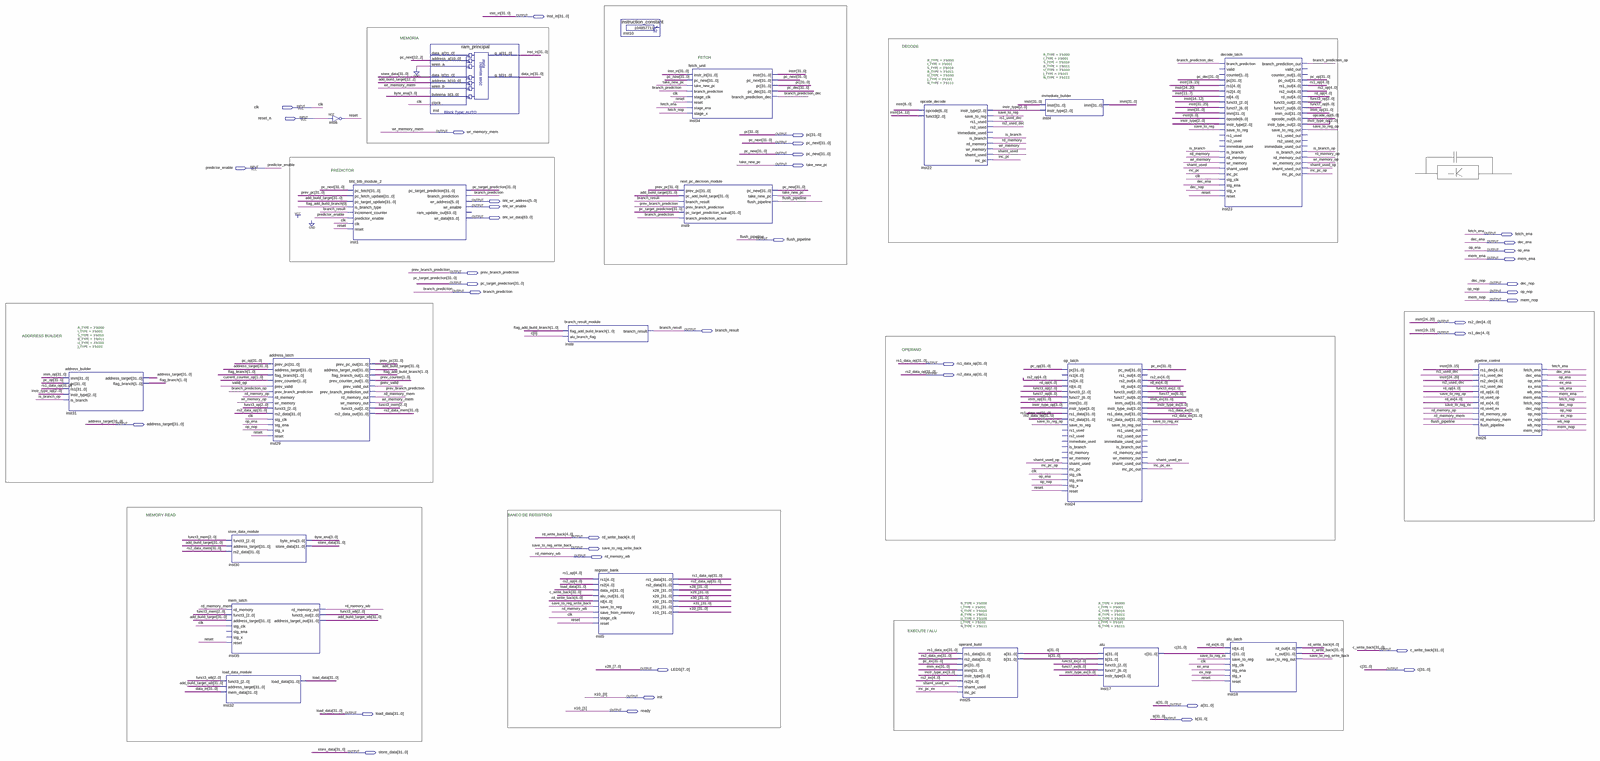
[diagram p0: schematic sheet, whole]
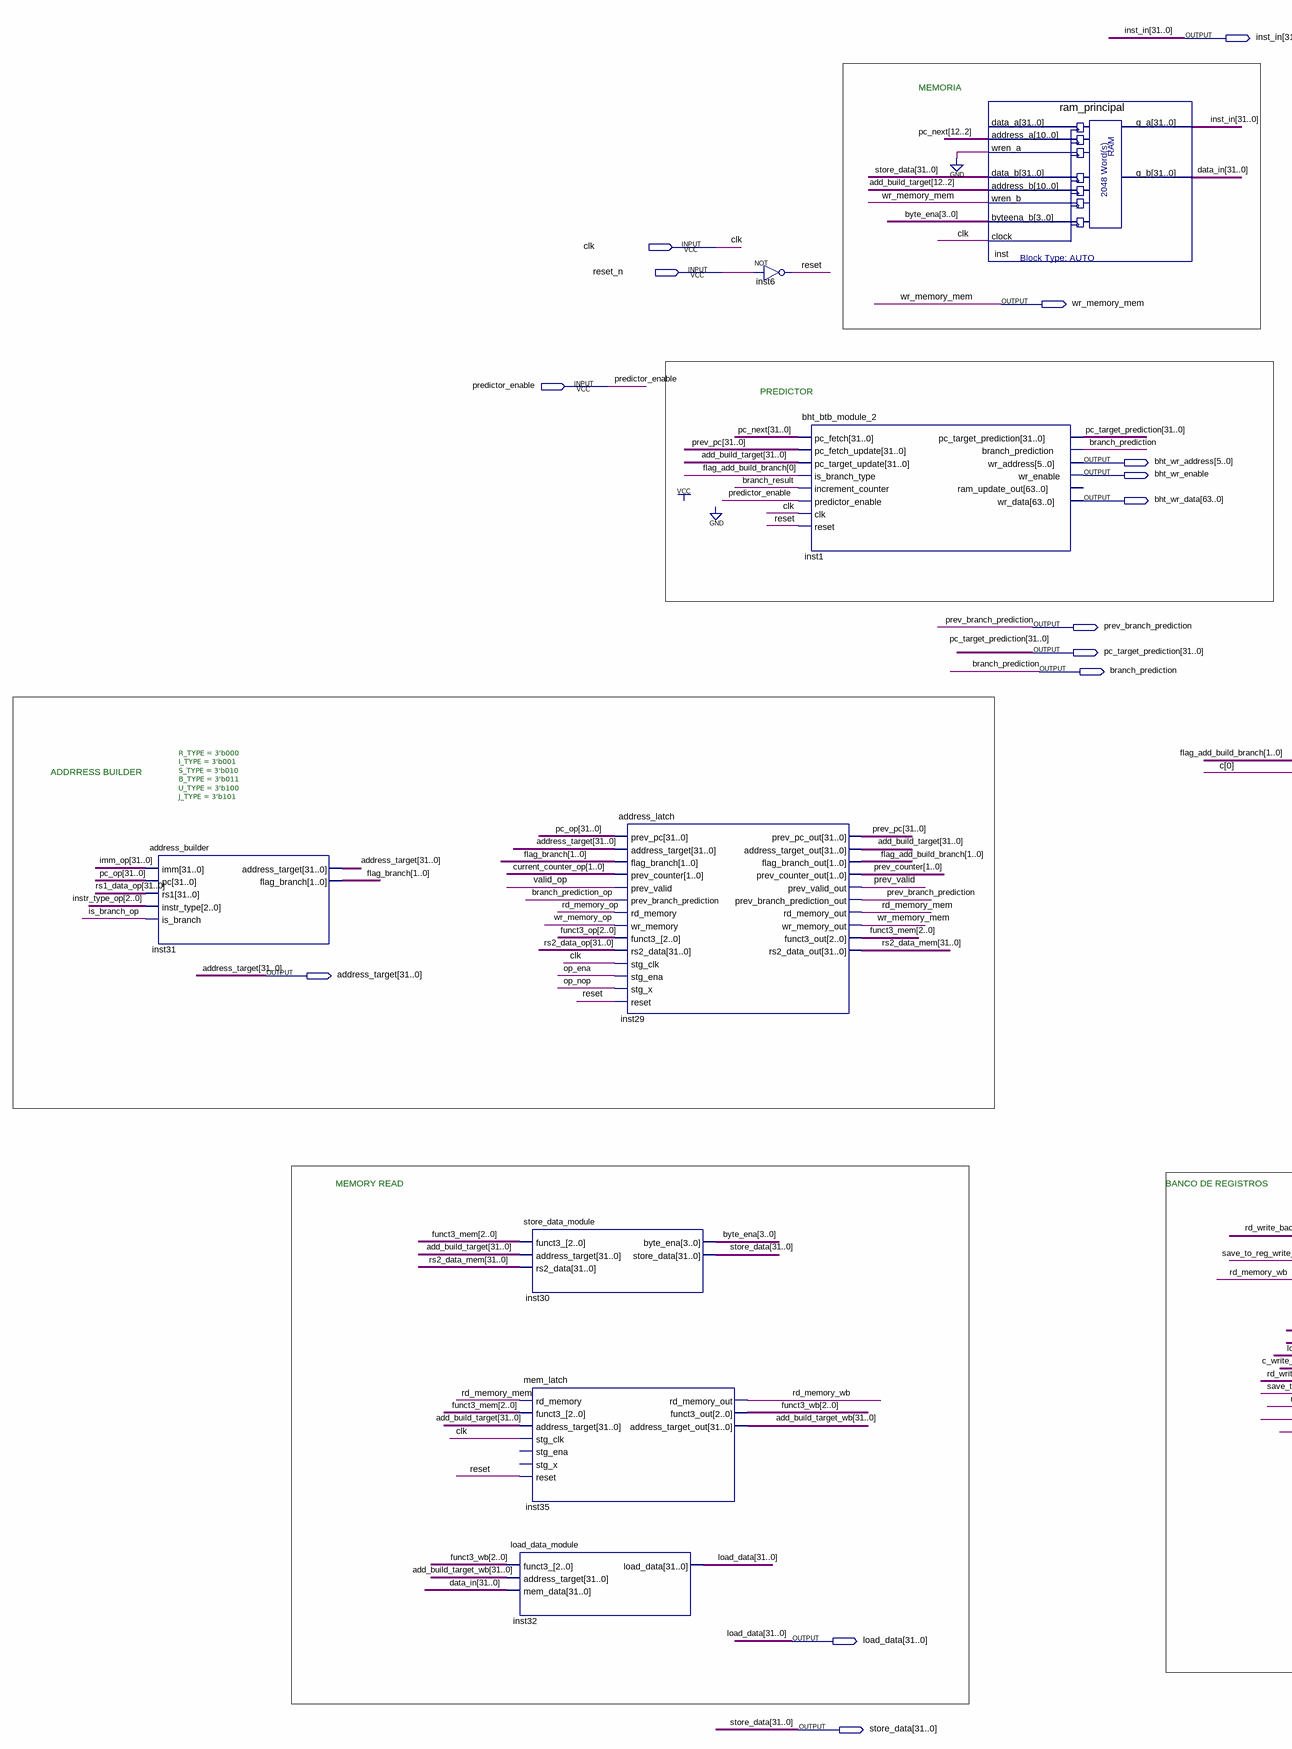
[diagram p1: schematic sheet, left part]
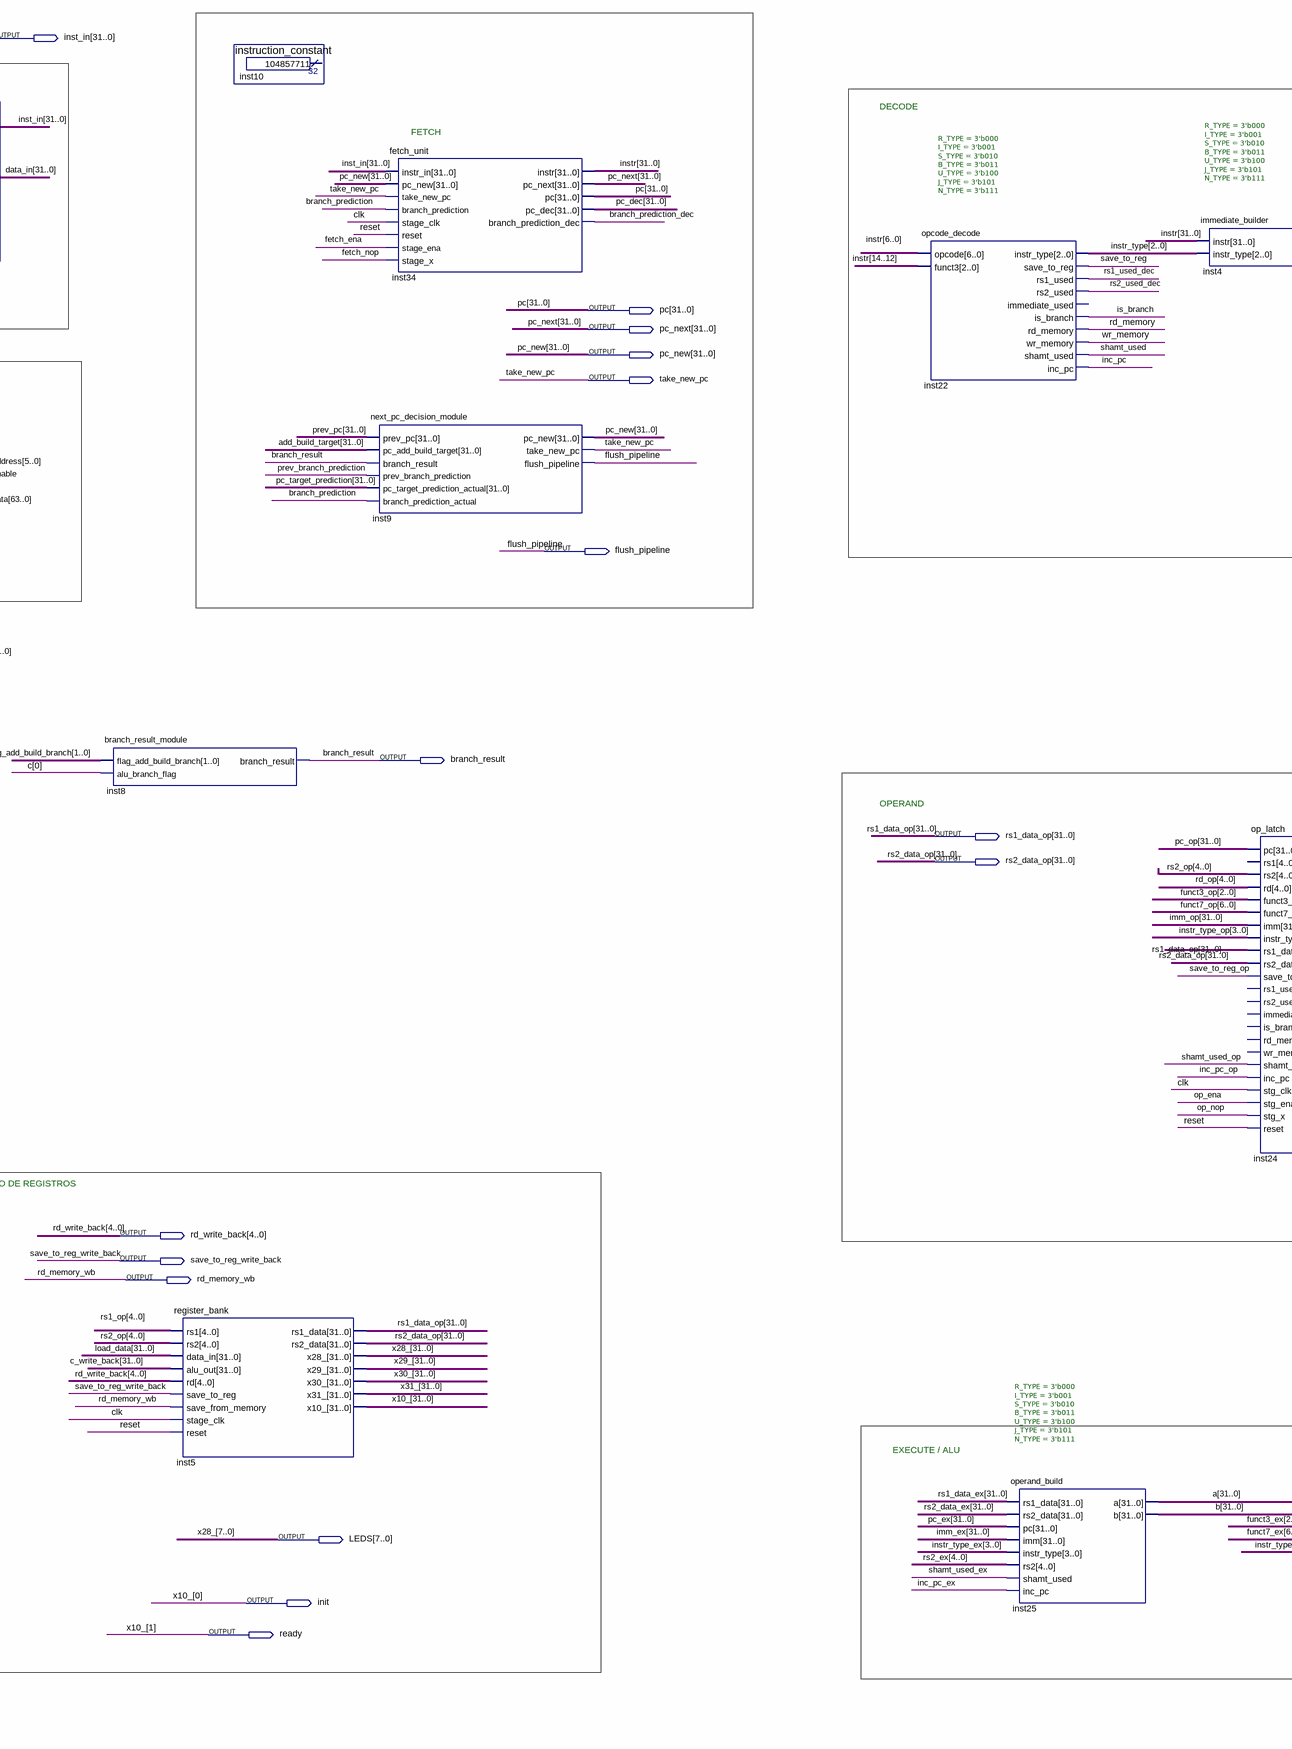
[diagram p2: schematic sheet, centre part]
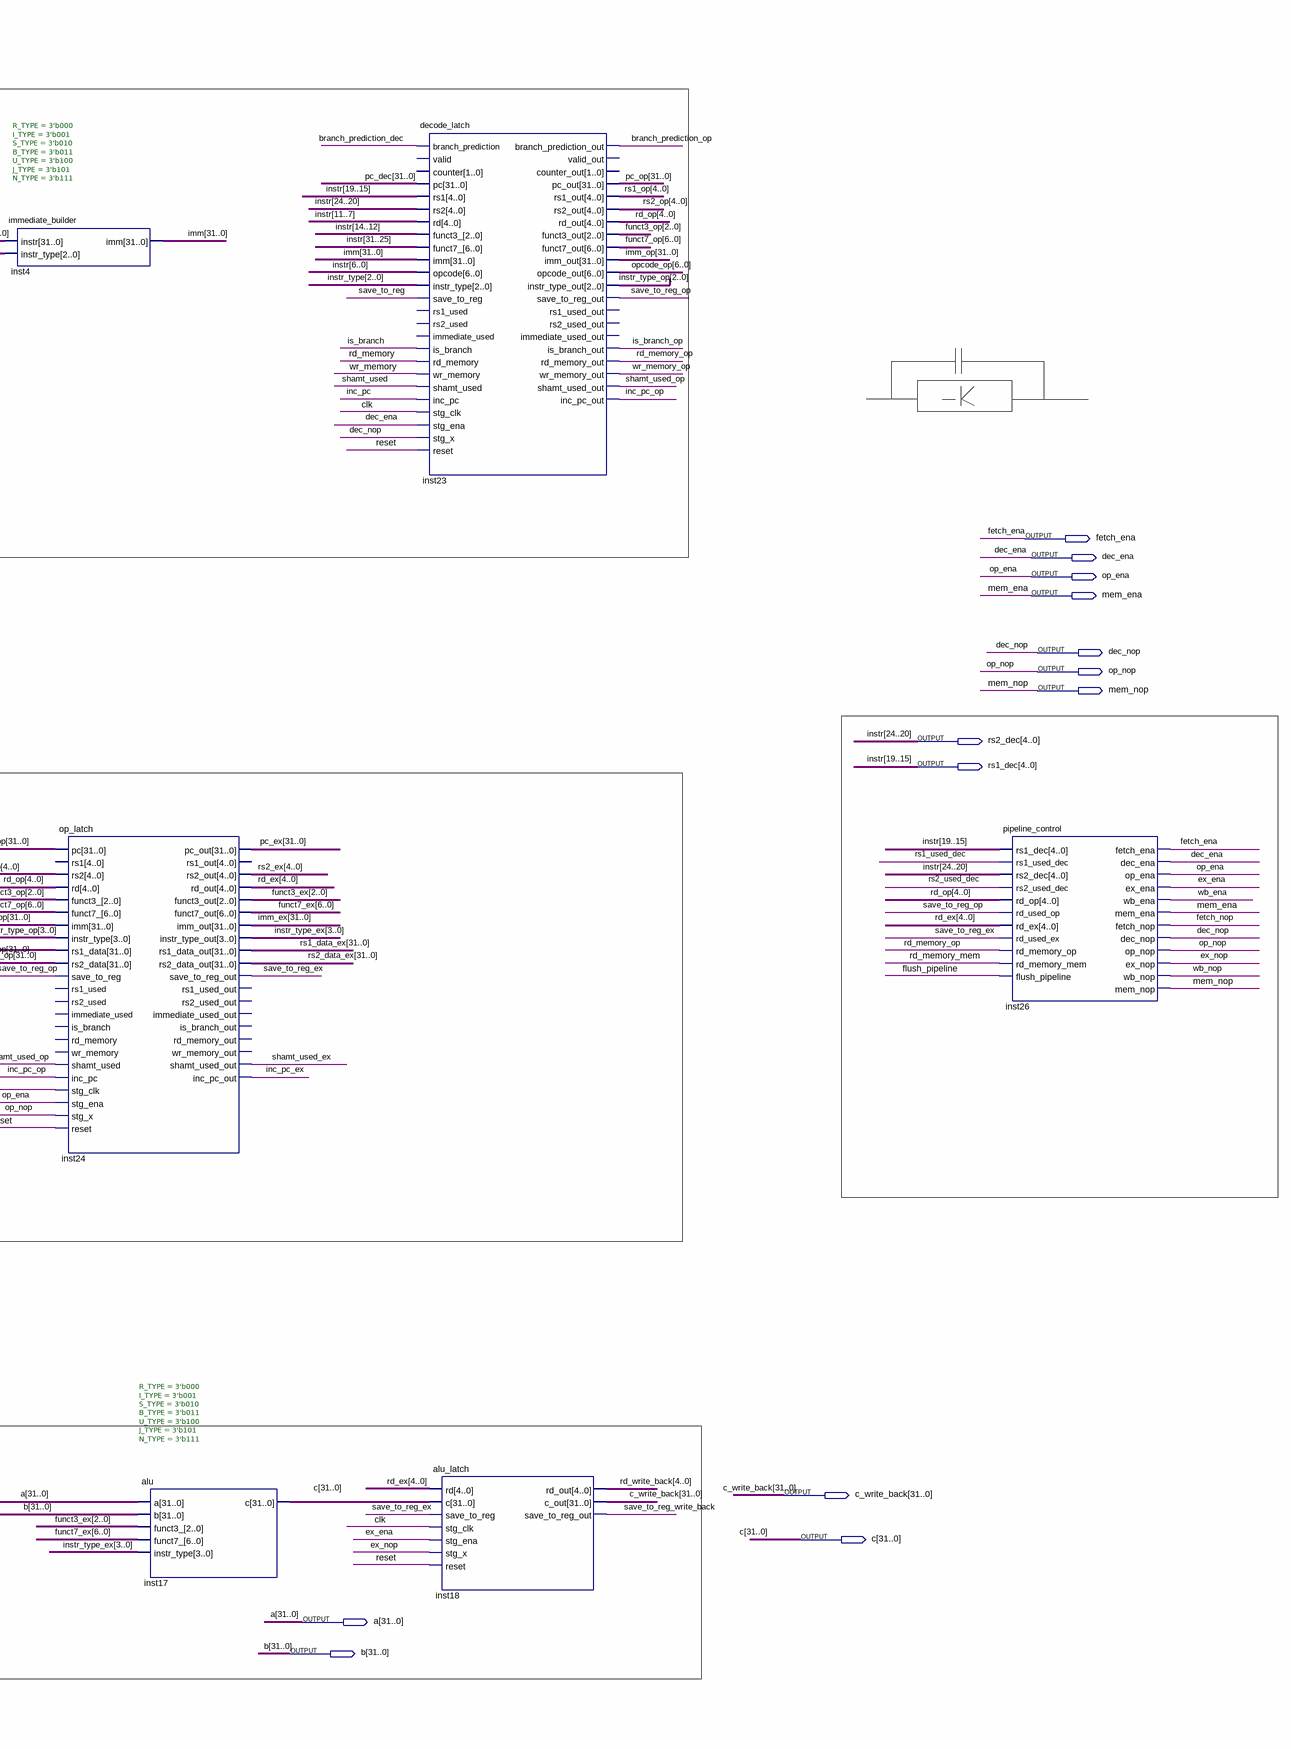
[diagram p3: schematic sheet, right part]
// Quartus schematic tp2_e5_ERV25_grupo2.bdf as structural Verilog: 21 symbols, 41 pins
module tp2_e5_ERV25_grupo2 (
  input  clk,
  input  reset_n,
  input  predictor_enable,
  output [31:0] inst_in,
  output wr_memory_mem,
  output [31:0] pc,
  output [31:0] pc_next,
  output [31:0] pc_new,
  output take_new_pc,
  output [5:0] bht_wr_address,
  output bht_wr_enable,
  output [63:0] bht_wr_data,
  output fetch_ena,
  output flush_pipeline,
  output dec_ena,
  output op_ena,
  output mem_ena,
  output prev_branch_prediction,
  output [31:0] pc_target_prediction,
  output dec_nop,
  output branch_prediction,
  output op_nop,
  output mem_nop,
  output [4:0] rs2_dec,
  output branch_result,
  output [4:0] rs1_dec,
  output [31:0] rs1_data_op,
  output [31:0] rs2_data_op,
  output [31:0] address_target,
  output [4:0] rd_write_back,
  output save_to_reg_write_back,
  output rd_memory_wb,
  output [31:0] c_write_back,
  output [7:0] LEDS,
  output [31:0] c,
  output init,
  output [31:0] a,
  output ready,
  output [31:0] load_data,
  output [31:0] b,
  output [31:0] store_data
);

  wire branch_prediction_dec, branch_prediction_op, ex_ena, ex_nop, fetch_nop, inc_pc, inc_pc_ex, inc_pc_op,
       is_branch, is_branch_op, prev_valid, rd_memory, rd_memory_mem, rd_memory_op, reset, rs1_used_dec,
       rs2_used_dec, save_to_reg, save_to_reg_ex, save_to_reg_op, shamt_used, shamt_used_ex, shamt_used_op,
       valid_op, wb_ena, wb_nop, wr_memory, wr_memory_op;
  wire [1:0] current_counter_op, flag_add_build_branch, flag_branch, prev_counter;
  wire [2:0] funct3_ex, funct3_mem, funct3_op, funct3_wb, instr_type;
  wire [3:0] byte_ena, instr_type_ex, instr_type_op;
  wire [4:0] rd_ex, rd_op, rs1_op, rs2_ex, rs2_op;
  wire [6:0] funct7_ex, funct7_op, opcode_op;
  wire [31:0] add_build_target, add_build_target_wb, data_in, imm, imm_ex, imm_op, instr, pc_dec, pc_ex,
       pc_op, prev_pc, rs1_data_ex, rs2_data_ex, rs2_data_mem, x29_, x30_, x31_;
  wire [31:2] x10_;
  wire [31:8] x28_;

  address_builder #(.R_TYPE(3'b000), .I_TYPE(3'b001), .S_TYPE(3'b010), .B_TYPE(3'b011), .U_TYPE(3'b100), .J_TYPE(3'b101)) inst31 (
    .imm(imm_op), .pc(pc_op), .rs1(rs1_data_op), .instr_type(instr_type_op[2:0]), .is_branch(is_branch_op),
    .address_target(address_target), .flag_branch(flag_branch));
  store_data_module inst30 (
    .funct3_(funct3_mem), .address_target(add_build_target), .rs2_data(rs2_data_mem), .byte_ena(byte_ena),
    .store_data(store_data));
  mem_latch inst35 (
    .rd_memory(rd_memory_mem), .funct3_(funct3_mem), .address_target(add_build_target), .stg_clk(clk),
    .reset(reset), .rd_memory_out(rd_memory_wb), .funct3_out(funct3_wb),
    .address_target_out(add_build_target_wb));  // open: stg_ena, stg_x
  load_data_module inst32 (
    .funct3_(funct3_wb), .address_target(add_build_target_wb), .mem_data(data_in), .load_data(load_data));
  address_latch inst29 (
    .prev_pc(pc_op), .address_target(address_target), .flag_branch(flag_branch),
    .prev_counter(current_counter_op), .prev_valid(valid_op), .prev_branch_prediction(branch_prediction_op),
    .rd_memory(rd_memory_op), .wr_memory(wr_memory_op), .funct3_(funct3_op), .rs2_data(rs2_data_op),
    .stg_clk(clk), .stg_ena(op_ena), .stg_x(op_nop), .reset(reset), .prev_pc_out(prev_pc),
    .address_target_out(add_build_target), .flag_branch_out(flag_add_build_branch),
    .prev_counter_out(prev_counter), .prev_valid_out(prev_valid),
    .prev_branch_prediction_out(prev_branch_prediction), .rd_memory_out(rd_memory_mem),
    .wr_memory_out(wr_memory_mem), .funct3_out(funct3_mem), .rs2_data_out(rs2_data_mem));
  not inst6 (reset, reset_n);
  bht_btb_module_2 inst1 (
    .pc_fetch(pc_next), .pc_fetch_update(prev_pc), .pc_target_update(add_build_target),
    .is_branch_type(flag_add_build_branch[0]), .increment_counter(branch_result),
    .predictor_enable(predictor_enable), .clk(clk), .reset(reset),
    .pc_target_prediction(pc_target_prediction), .branch_prediction(branch_prediction),
    .wr_address(bht_wr_address), .wr_enable(bht_wr_enable), .wr_data(bht_wr_data));  // open: ram_update_out
  ram_principal inst (
    .address_a(pc_next[12:2]), .wren_a(1'b0), .data_b(store_data), .address_b(add_build_target[12:2]),
    .wren_b(wr_memory_mem), .byteena_b(byte_ena), .clock(clk), .q_a(inst_in), .q_b(data_in));  // open: data_a
  branch_result_module inst8 (
    .flag_add_build_branch(flag_add_build_branch), .alu_branch_flag(c[0]), .branch_result(branch_result));
  register_bank inst5 (
    .rs1(rs1_op), .rs2(rs2_op), .data_in(load_data), .alu_out(c_write_back), .rd(rd_write_back),
    .save_to_reg(save_to_reg_write_back), .save_from_memory(rd_memory_wb), .stage_clk(clk), .reset(reset),
    .rs1_data(rs1_data_op), .rs2_data(rs2_data_op), .x28_({x28_, LEDS}), .x29_(x29_), .x30_(x30_),
    .x31_(x31_), .x10_({x10_, ready, init}));
  instruction_constant inst10 ();  // open: result
  fetch_unit inst34 (
    .instr_in(inst_in), .pc_new(pc_new), .take_new_pc(take_new_pc), .branch_prediction(branch_prediction),
    .stage_clk(clk), .reset(reset), .stage_ena(fetch_ena), .stage_x(fetch_nop),
    .instr({instr[31:25], rs2_dec, rs1_dec, instr[14:0]}), .pc_next(pc_next), .pc(pc), .pc_dec(pc_dec),
    .branch_prediction_dec(branch_prediction_dec));
  next_pc_decision_module inst9 (
    .prev_pc(prev_pc), .pc_add_build_target(add_build_target), .branch_result(branch_result),
    .prev_branch_prediction(prev_branch_prediction), .pc_target_prediction_actual(pc_target_prediction),
    .branch_prediction_actual(branch_prediction), .pc_new(pc_new), .take_new_pc(take_new_pc),
    .flush_pipeline(flush_pipeline));
  opcode_decode #(.R_TYPE(3'b000), .I_TYPE(3'b001), .S_TYPE(3'b010), .B_TYPE(3'b011), .U_TYPE(3'b100), .J_TYPE(3'b101), .N_TYPE(3'b111)) inst22 (
    .opcode(instr[6:0]), .funct3(instr[14:12]), .instr_type(instr_type), .save_to_reg(save_to_reg),
    .rs1_used(rs1_used_dec), .rs2_used(rs2_used_dec), .is_branch(is_branch), .rd_memory(rd_memory),
    .wr_memory(wr_memory), .shamt_used(shamt_used), .inc_pc(inc_pc));  // open: immediate_used
  operand_build #(.R_TYPE(3'b000), .I_TYPE(3'b001), .S_TYPE(3'b010), .B_TYPE(3'b011), .U_TYPE(3'b100), .J_TYPE(3'b101), .N_TYPE(3'b111)) inst25 (
    .rs1_data(rs1_data_ex), .rs2_data(rs2_data_ex), .pc(pc_ex), .imm(imm_ex), .instr_type(instr_type_ex),
    .rs2(rs2_ex), .shamt_used(shamt_used_ex), .inc_pc(inc_pc_ex), .a(a), .b(b));
  immediate_builder #(.R_TYPE(3'b000), .I_TYPE(3'b001), .S_TYPE(3'b010), .B_TYPE(3'b011), .U_TYPE(3'b100), .J_TYPE(3'b101), .N_TYPE(3'b111)) inst4 (
    .instr({instr[31:25], rs2_dec, rs1_dec, instr[14:0]}), .instr_type(instr_type), .imm(imm));
  op_latch inst24 (
    .pc(pc_op), .rs2(rs2_op), .rd(rd_op), .funct3_(funct3_op), .funct7_(funct7_op), .imm(imm_op),
    .instr_type(instr_type_op), .rs1_data(rs1_data_op), .rs2_data(rs2_data_op), .save_to_reg(save_to_reg_op),
    .shamt_used(shamt_used_op), .inc_pc(inc_pc_op), .stg_clk(clk), .stg_ena(op_ena), .stg_x(op_nop),
    .reset(reset), .pc_out(pc_ex), .rs2_out(rs2_ex), .rd_out(rd_ex), .funct3_out(funct3_ex),
    .funct7_out(funct7_ex), .imm_out(imm_ex), .instr_type_out(instr_type_ex), .rs1_data_out(rs1_data_ex),
    .rs2_data_out(rs2_data_ex), .save_to_reg_out(save_to_reg_ex), .shamt_used_out(shamt_used_ex),
    .inc_pc_out(inc_pc_ex));  // open: rs1, rs1_used, rs2_used, immediate_used, is_branch, rd_memory, wr_memory, rs1_out, rs1_used_out, rs2_used_out, immediate_used_out, is_branch_out, rd_memory_out, wr_memory_out
  alu #(.R_TYPE(3'b000), .I_TYPE(3'b001), .S_TYPE(3'b010), .B_TYPE(3'b011), .U_TYPE(3'b100), .J_TYPE(3'b101), .N_TYPE(3'b111)) inst17 (
    .a(a), .b(b), .funct3_(funct3_ex), .funct7_(funct7_ex), .instr_type(instr_type_ex), .c(c));
  decode_latch inst23 (
    .branch_prediction(branch_prediction_dec), .pc(pc_dec), .rs1(rs1_dec), .rs2(rs2_dec), .rd(instr[11:7]),
    .funct3_(instr[14:12]), .funct7_(instr[31:25]), .imm(imm), .opcode(instr[6:0]), .instr_type(instr_type),
    .save_to_reg(save_to_reg), .is_branch(is_branch), .rd_memory(rd_memory), .wr_memory(wr_memory),
    .shamt_used(shamt_used), .inc_pc(inc_pc), .stg_clk(clk), .stg_ena(dec_ena), .stg_x(dec_nop),
    .reset(reset), .branch_prediction_out(branch_prediction_op), .pc_out(pc_op), .rs1_out(rs1_op),
    .rs2_out(rs2_op), .rd_out(rd_op), .funct3_out(funct3_op), .funct7_out(funct7_op), .imm_out(imm_op),
    .opcode_out(opcode_op), .instr_type_out(instr_type_op[2:0]), .save_to_reg_out(save_to_reg_op),
    .is_branch_out(is_branch_op), .rd_memory_out(rd_memory_op), .wr_memory_out(wr_memory_op),
    .shamt_used_out(shamt_used_op), .inc_pc_out(inc_pc_op));  // open: valid, counter, rs1_used, rs2_used, immediate_used, valid_out, counter_out, rs1_used_out, rs2_used_out, immediate_used_out
  alu_latch inst18 (
    .rd(rd_ex), .c(c), .save_to_reg(save_to_reg_ex), .stg_clk(clk), .stg_ena(ex_ena), .stg_x(ex_nop),
    .reset(reset), .rd_out(rd_write_back), .c_out(c_write_back), .save_to_reg_out(save_to_reg_write_back));
  pipeline_control inst26 (
    .rs1_dec(rs1_dec), .rs1_used_dec(rs1_used_dec), .rs2_dec(rs2_dec), .rs2_used_dec(rs2_used_dec),
    .rd_op(rd_op), .rd_used_op(save_to_reg_op), .rd_ex(rd_ex), .rd_used_ex(save_to_reg_ex),
    .rd_memory_op(rd_memory_op), .rd_memory_mem(rd_memory_mem), .flush_pipeline(flush_pipeline),
    .fetch_ena(fetch_ena), .dec_ena(dec_ena), .op_ena(op_ena), .ex_ena(ex_ena), .wb_ena(wb_ena),
    .mem_ena(mem_ena), .fetch_nop(fetch_nop), .dec_nop(dec_nop), .op_nop(op_nop), .ex_nop(ex_nop),
    .wb_nop(wb_nop), .mem_nop(mem_nop));

  // Other names for the same wires on the sheet: instr[24:15] = {rs2_dec, rs1_dec}; x10_[1:0] = {ready, init};
  //   x28_[7:0] = LEDS

  // Notes on the sheet:
  //   MEMORIA
  //   DECODE
  //   FETCH
  //   PREDICTOR
  //   ADDRRESS BUILDER
  //   OPERAND
  //   MEMORY READ
  //   BANCO DE REGISTROS
  //   EXECUTE / ALU
endmodule
